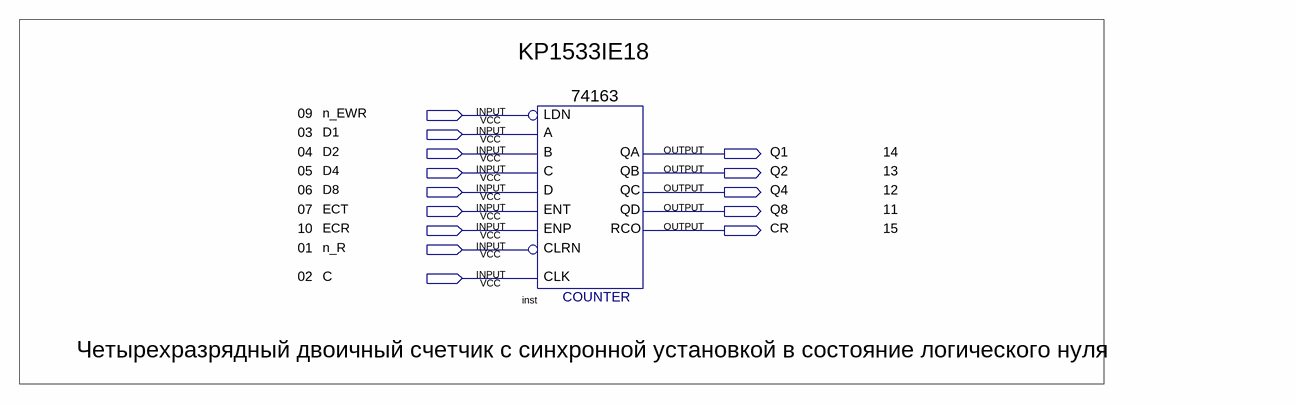
[diagram p0: schematic sheet]
// Quartus schematic KP1533IE18.bdf as structural Verilog: 1 symbols, 14 pins
module KP1533IE18 (
  input  n_EWR,
  input  D1,
  input  D2,
  input  D4,
  input  D8,
  input  ECT,
  input  ECR,
  input  n_R,
  input  C,
  output Q1,
  output Q2,
  output Q4,
  output Q8,
  output CR
);

  \74163  inst (
    .C(D4), .B(D2), .A(D1), .ENT(ECT), .D(D8), .CLRN(n_R), .CLK(C), .ENP(ECR), .LDN(n_EWR), .QA(Q1), .QB(Q2),
    .QC(Q4), .QD(Q8), .RCO(CR));

  // Notes on the sheet:
  //   KP1533IE18
  //   09
  //   03
  //   04
  //   14
  //   05
  //   13
  //   06
  //   12
  //   07
  //   11
  //   10
  //   15
  //   01
  //   02
  //   Четырехразрядный двоичный счетчик с синхронной установкой в состояние логического нуля
endmodule
